# EAGLE design aa battery lado a lado (EAGLE 6.6.0)
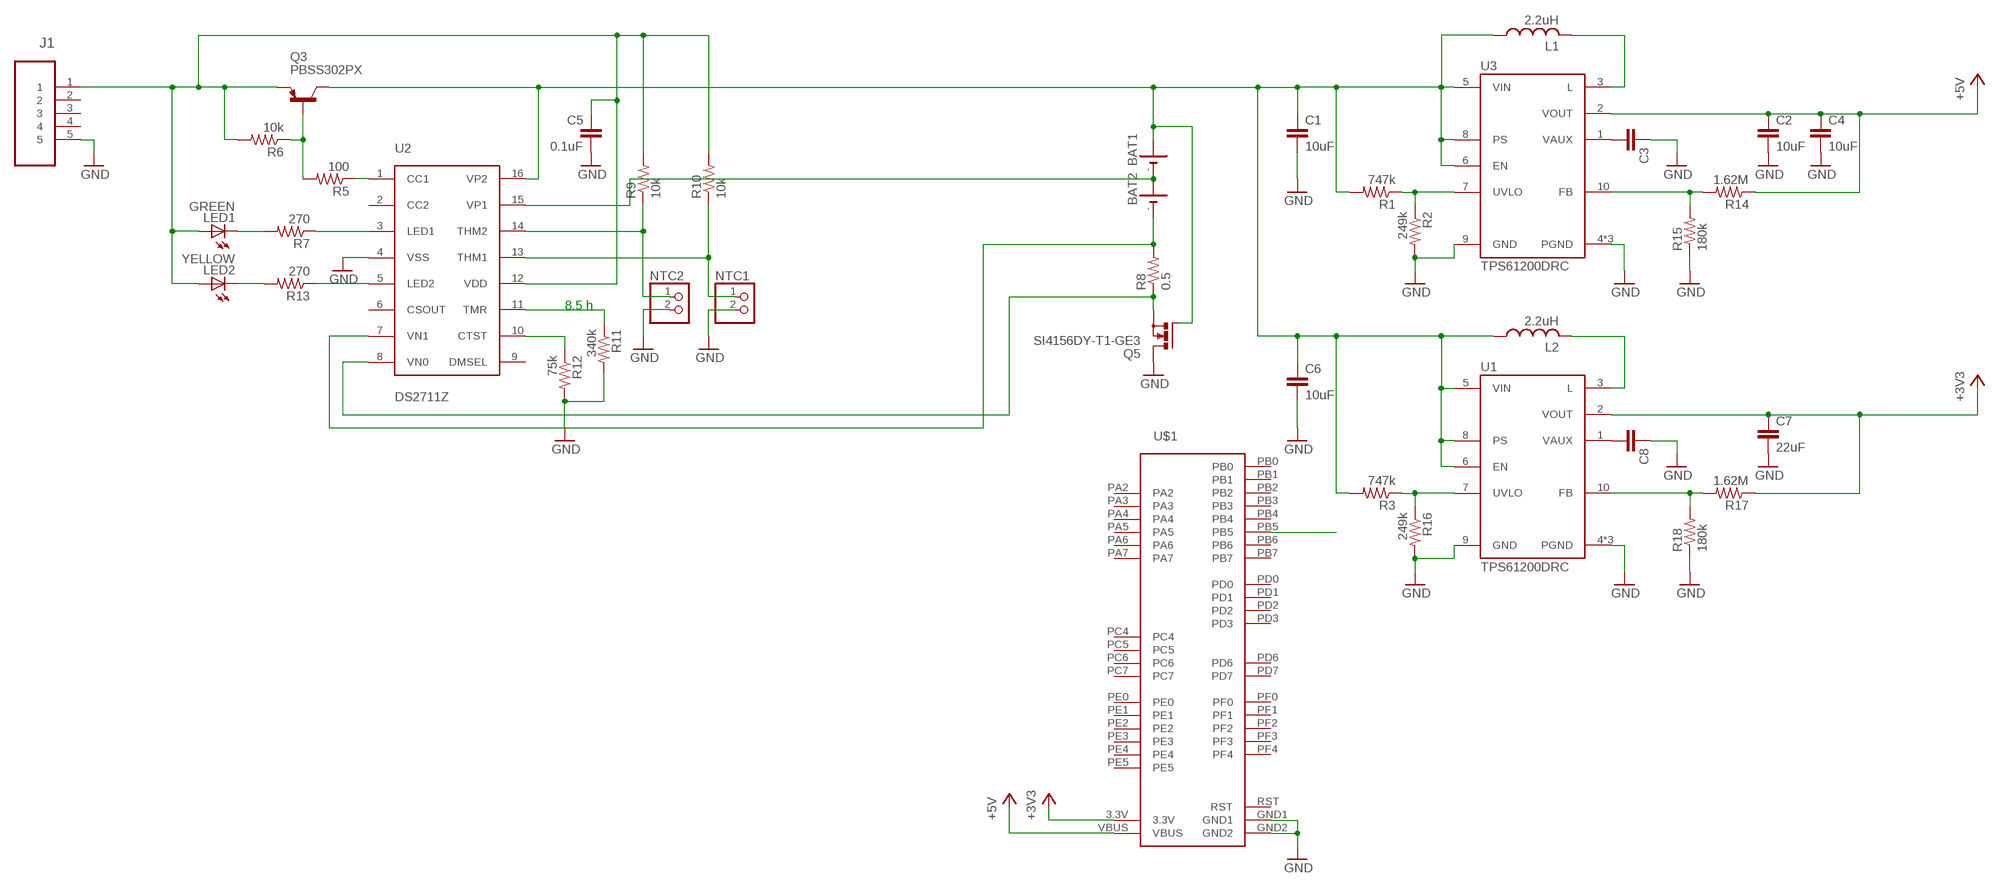
[diagram p0: schematic, sheet 1]

## Parts
BAT1  AA-SNGLKEYSTONE2460  [KEYSTONE2460]
BAT2  AA-SNGLKEYSTONE2460  [KEYSTONE2460]
C1  10uF  C-EUC0805  [C0805]
C2  10uF  C-EUC0805  [C0805]
C3  C-EUC0805  [C0805]
C4  10uF  C-EUC0805  [C0805]
C5  0.1uF  C-EUC0805  [C0805]
C6  10uF  C-EUC0805  [C0805]
C7  22uF  C-EUC0805  [C0805]
C8  C-EUC0603  [C0603]
J1  47346-0001  [MOLEX_47346-0001]
L1  2.2uH  L-USXAL4040  [XAL4040]
L2  2.2uH  L-USXAL4040  [XAL4040]
LED1  GREEN  LEDSML1206  [SML1206]
LED2  YELLOW  LEDSML1206  [SML1206]
NTC1  PINHD-1X2  [1X02]
NTC2  PINHD-1X2  [1X02]
Q3  PBSS302PX  BF621-PNP-SOT98-BCE  [SOT89-BCE]
Q5  SI4156DY-T1-GE3  N-MOSFET-SO8S  [SO-08]
R1  747k  R-US_R0603  [R0603]
R2  249k  R-US_R0603  [R0603]
R3  747k  R-US_R0603  [R0603]
R5  100  R-US_R0805  [R0805]
R6  10k  R-US_R0805  [R0805]
R7  270  R-US_R0805  [R0805]
R8  0.5  R-US_R0805  [R0805]
R9  10k  R-US_R0805  [R0805]
R10  10k  R-US_R0805  [R0805]
R11  340k  R-US_R0805  [R0805]
R12  75k  R-US_R0805  [R0805]
R13  270  R-US_R0805  [R0805]
R14  1.62M  R-US_R0603  [R0603]
R15  180k  R-US_R0603  [R0603]
R16  249k  R-US_R0603  [R0603]
R17  1.62M  R-US_R0603  [R0603]
R18  180k  R-US_R0603  [R0603]
U1  TPS61200DRC  [DRC10_2P4X1P65]
U2  DS2711Z  [SO16]
U3  TPS61200DRC  [DRC10_2P4X1P65]
U$1  STELLARIS-LAUNCHPADSTELLARIS-LAUNCHPAD-XL-HALF-LENGTH  [LAUNCHPAD-XL-HALF-LENGTH]

## Nets
+3V3: C7.1 R17.1 U1.2(VOUT) U$1.3.3V
+5V: C2.1 C4.1 R14.1 U3.2(VOUT) U$1.VBUS
CHG_VCC: C5.1 J1.1 LED1.A LED2.A Q3.E R6.2 R9.2 R10.2 U2.12(VDD)
GND: C1.2 C2.2 C3.1 C4.2 C5.2 C6.2 C7.2 C8.1 J1.5 NTC1.2 NTC2.2 Q5.5(D) Q5.6(D) Q5.7(D) Q5.8(D) R2.2 R11.2 R12.2 R15.1 R16.2 R18.1 U1.4(PGND) U1.9(GND) U1.11(PGND) U1.12(PGND) U2.4(VSS) U3.4(PGND) U3.9(GND) U3.11(PGND) U3.12(PGND) U$1.GND1 U$1.GND2
N$1: BAT1.+ C1.1 C6.1 L1.1 L2.1 Q3.C Q3.C@1(C) Q5.4(G) R1.2 R3.2 U1.5(VIN) U1.6(EN) U1.8(PS) U2.16(VP2) U3.5(VIN) U3.6(EN) U3.8(PS)
N$2: L2.2 U1.3(L)
N$3: R1.1 R2.1 U3.7(UVLO)
N$4: C3.2 U3.1(VAUX)
N$5: R14.2 R15.2 U3.10(FB)
N$6: R3.1 R16.1 U1.7(UVLO)
N$7: Q3.B R5.2 R6.1
N$8: L1.2 U3.3(L)
N$9: C8.2 U1.1(VAUX)
N$10: R5.1 U2.1(CC1)
N$12: R17.2 R18.2 U1.10(FB)
N$13: BAT1.- BAT2.+ U2.15(VP1)
N$14: BAT2.- R8.2 U2.7(VN1)
N$15: LED1.C R7.2
N$16: R7.1 U2.3(LED1)
N$17: NTC2.1 R9.1 U2.14(THM2)
N$18: NTC1.1 R10.1 U2.13(THM1)
N$19: R13.1 U2.5(LED2)
N$20: R12.1 U2.10(CTST)
N$21: R11.1 U2.11(TMR)
N$22: LED2.C R13.2
N$24: Q5.1(S) Q5.2(S) Q5.3(S) R8.1 U2.8(VN0)
N$25: U$1.PB5
Unconnected: J1.2 J1.3 J1.4 U2.2(CC2) U2.6(CSOUT) U2.9(DMSEL) U$1.PA2 U$1.PA3 U$1.PA4 U$1.PA5 U$1.PA6 U$1.PA7 U$1.PB0 U$1.PB1 U$1.PB2 U$1.PB3 U$1.PB4 U$1.PB6 U$1.PB7 U$1.PC4 U$1.PC5 U$1.PC6 U$1.PC7 U$1.PD0 U$1.PD1 U$1.PD2 U$1.PD3 U$1.PD6 U$1.PD7 U$1.PE0 U$1.PE1 U$1.PE2 U$1.PE3 U$1.PE4 U$1.PE5 U$1.PF0 U$1.PF1 U$1.PF2 U$1.PF3 U$1.PF4

## Notes on the sheet
- 8.5 h

## Power pins joined to a net without a drawn wire
RST: U$1.RST

## Library data of the parts
BAT1 BAT2 = battery holders:AA-SNGL
C1-C8 = rcl:C-EU: CAPACITOR, European symbol
J1 = Molex-47346-0001:47346-0001: CONN RCPT 5POS MICRO USB R/A SMD; MPN: 47346-0001; OC_FARNELL: 1568026; OC_NEWARK: 47M0505; PACKAGE: 5 POS MICRO USB R/A; SUPPLIER: MOLEX
L1 L2 = inductors:L-US: INDUCTOR, American symbol
LED1 LED2 = led:LED: LED OSRAM: - CHIPLED LG R971, LG N971, LY N971, LG Q971, LY Q971, LO R971, LY R971 LH N974, LH R974 LS Q976, LO Q976, LY Q976 LO Q996 - Hyper CHIPLED LW Q18S LB Q993, LB Q99A, LB R99A - SideLED LS A670, LO A670, LY A670, LG A670, LP A670 LB A673, LV A673, LT A673, LW A673 LH A674 LY A675 LS A676, LA A676, LO A676, LY A676, LW A676 LS A679, LY A679, LG A679 - Hyper Micro SIDELED® LS Y876, LA Y876, LO Y876, LY Y876 LT Y87S - SmartLED LW L88C, LW L88S LB L89C, LB L89S, LG L890 LS L89K, LO L89K, LY L89K LS L896, LA L896, LO L896, LY L896 - TOPLED LS T670, LO T670, LY T670, LG T670, LP T670 LSG T670, LSP T670, LSY T670, LOP T670, LYG T670 LG T671, LOG T671, LSG T671 LB T673, LV T673, LT T673, LW T673 LH T674 LS T676, LA T676, LO T676, LY T676, LB T676, LH T676, LSB T676, LW T676 LB T67C, LV T67C, LT T67C, LS T67K, LO T67K, LY T67K, LW E67C LS E67B, LA E67B, LO E67B, LY E67B, LB E67C, LV E67C, LT E67C LW T67C LS T679, LY T679, LG T679 LS T770, LO T770, LY T770, LG T770, LP T770 LB T773, LV T773, LT T773, LW T773 LH T774 LS E675, LA E675, LY E675, LS T675 LS T776, LA T776, LO T776, LY T776, LB T776 LHGB T686 LT T68C, LB T68C - Hyper Mini TOPLED® LB M676 - Mini TOPLED Santana® LG M470 LS M47K, LO M47K, LY M47K Source: http://www.osram.convergy.de LUXEON: - LUMILED® LXK2-PW12-R00, LXK2-PW12-S00, LXK2-PW14-U00, LXK2-PW14-V00 LXK2-PM12-R00, LXK2-PM12-S00, LXK2-PM14-U00 LXK2-PE12-Q00, LXK2-PE12-R00, LXK2-PE12-S00, LXK2-PE14-T00, LXK2-PE14-U00 LXK2-PB12-K00, LXK2-PB12-L00, LXK2-PB12-M00, LXK2-PB14-N00, LXK2-PB14-P00, LXK2-PB14-Q00 LXK2-PR12-L00, LXK2-PR12-M00, LXK2-PR14-Q00, LXK2-PR14-R00 LXK2-PD12-Q00, LXK2-PD12-R00, LXK2-PD12-S00 LXK2-PH12-R00, LXK2-PH12-S00 LXK2-PL12-P00, LXK2-PL12-Q00, LXK2-PL12-R00 Source: www.luxeon.com KINGBRIGHT: KA-3528ASYC Source: www.kingbright.com
NTC1 NTC2 = pinhead:PINHD-1X2: PIN HEADER
Q3 = transistor-neu-to92:*-PNP-: PNP Transistror
Q5 = transistor-power:N-MOSFET-SO8: N-Channel MOSFET Example: FDS7760A; N-Channel Logic Level PowerTrench® MOSFET FDS2572; N-Channel UltraFET® Trench MOSFET Source: www.fairchildsemi.com
R1-R3 R5-R18 = rcl:R-US_: RESISTOR, American symbol
U1 U3 = tps61200:TPS61200
U2 = DS2711:DS2711
U$1 = StellarisLaunchPad_Fred:STELLARIS-LAUNCHPAD

## Board
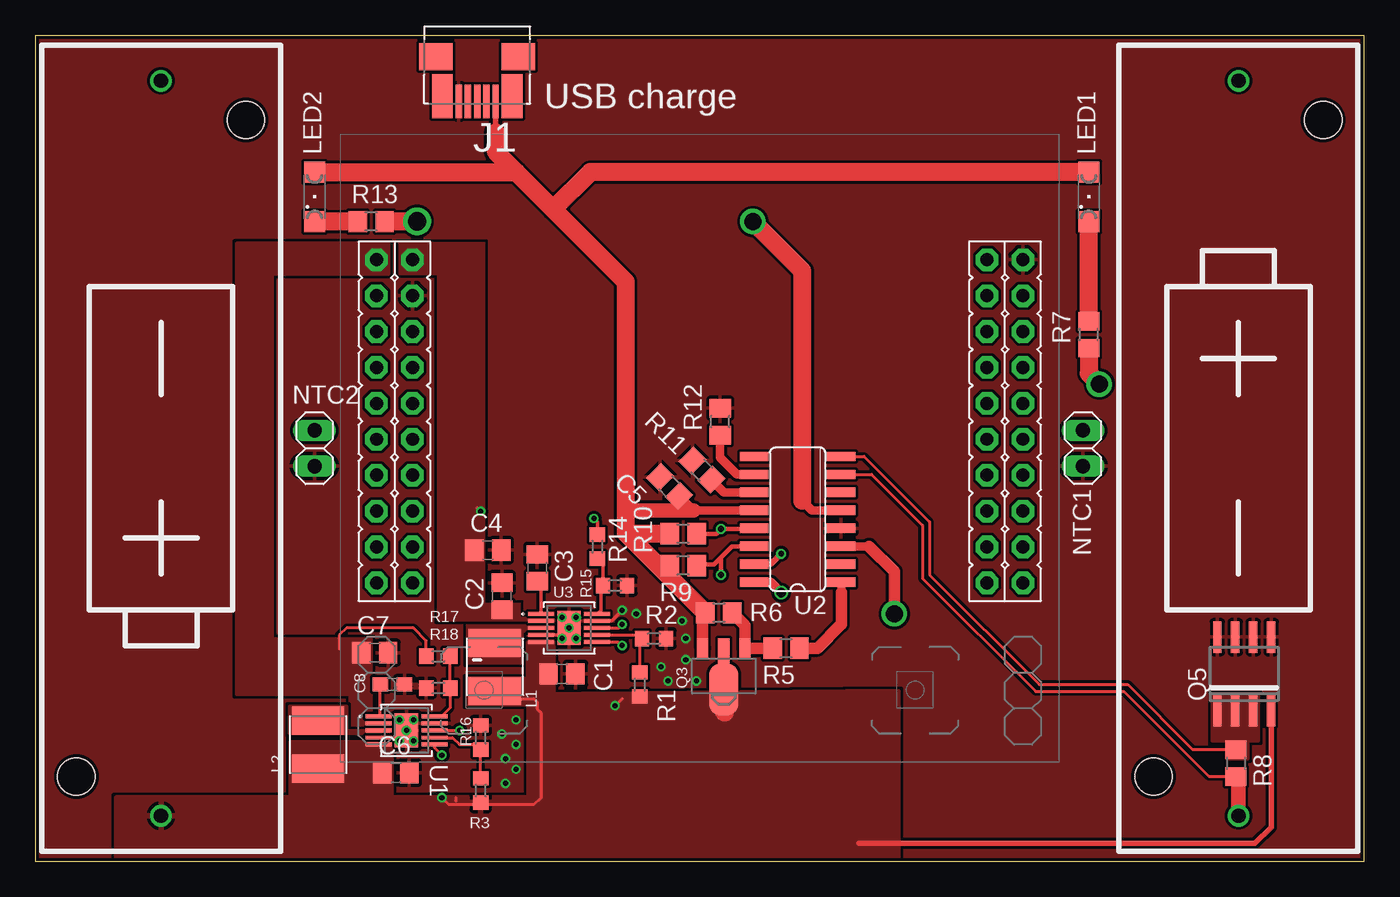
[diagram p1: board, top side]
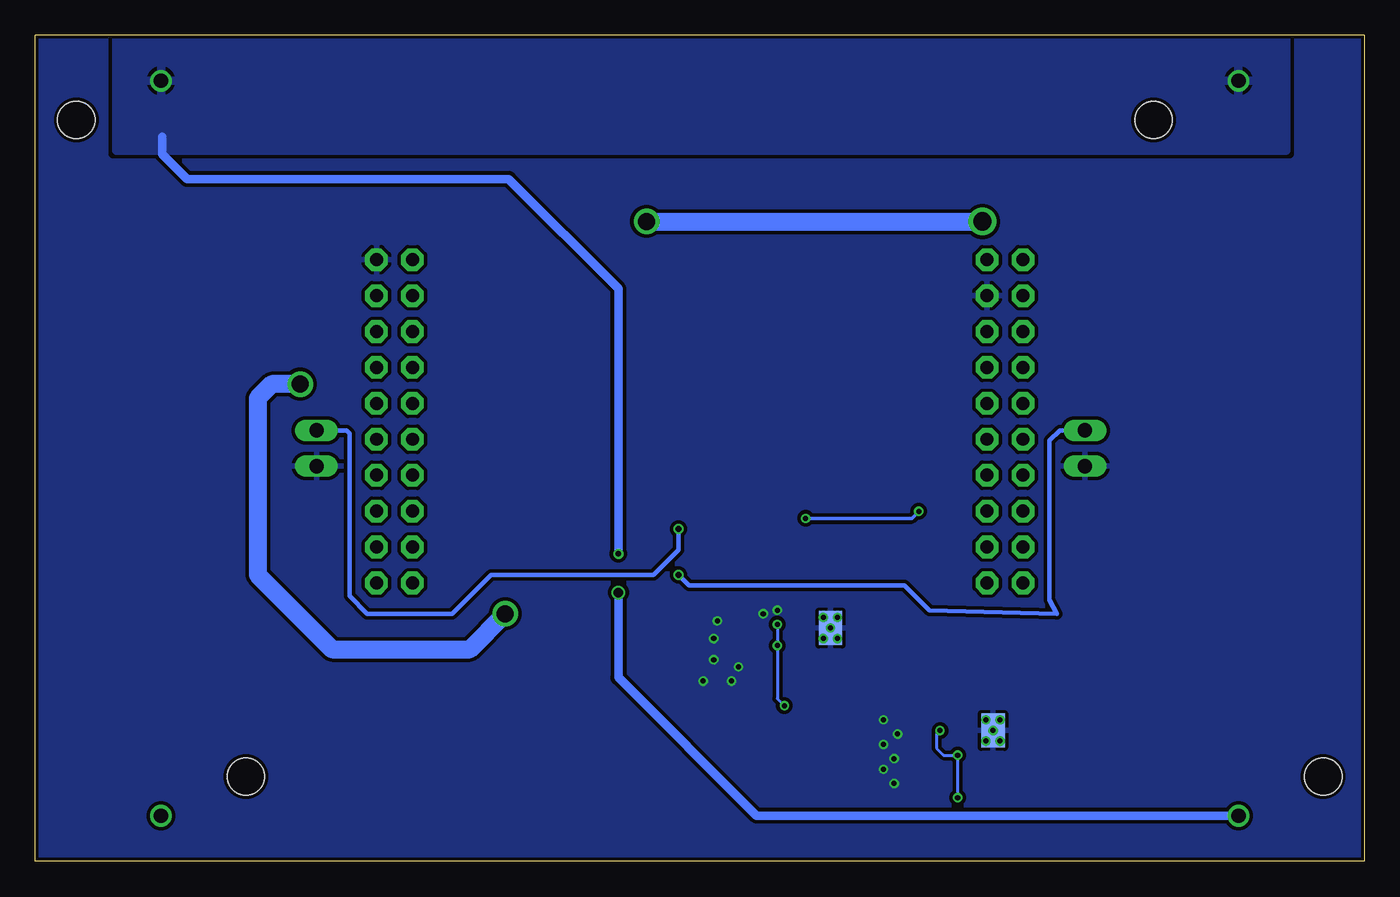
[diagram p2: board, bottom side, seen from below]

Size 93.98 x 58.42 mm. Coordinates in mm from the lower left corner, seen from the top.
Outline: 0,58.42 0,0 93.98,0 93.98,58.42 0,58.42
Copper layers (1*16): Top 0.035mm / dielectric 1.5mm / Bottom 0.035mm
Design rules "ITEADstudio_DRC": minimum track width 6mil, minimum drill 12mil, track to track 6mil, track to pad 6mil, pad to pad 6mil, via to via 6mil, smd to smd 0mil, copper to edge 10mil, drill to drill 10mil, minimum pad ring 10mil, minimum via ring 6mil, stop-mask expansion 2mil, vias tented up to drill 100mil, thermal gap 10mil

### Footprints (pad centres in the part's own frame; a part is rotated, then mirrored left to right if it is on the bottom)
KEYSTONE2460 = drill 1.016: + 25.997,0; - -25.997,0 | hole 2.642: -23.228,5.994; 23.228,-5.994
C0805 = smd 1.3 x 1.5: 1 -0.95,0; 2 0.95,0
C0603 = smd 1.1 x 1: 1 -0.85,0; 2 0.85,0
MOLEX_47346-0001 = smd 0.45 x 2.38: 1 -1.3,0.5; 2 -0.65,0.5; 3 0,0.5; 4 0.65,0.5; 5 1.3,0.5 | smd 1.475 x 3.1: M1 -2.462,0.14; M2 2.462,0.14 | smd 2.375 x 1.9: M3 -2.913,-2.66; M6 2.913,-2.66
XAL4040 = smd 2 x 3.7: 1 -1.695,0; 2 1.695,0
SML1206 = smd 1.5 x 1.5: A 1.75,0; C -1.75,0
1X02 = drill 1.016 long: 1 -1.27,0; 2 1.27,0
SOT89-BCE = smd 0.8 x 1.4: B -1.499,-1.981; E 1.499,-1.981 | smd 0.8 x 1.9: C 0,-1.727 | smd 2.032 x 3.65: C@1 0,0.94
SO-08 = smd 0.6 x 2.2: 1 -1.905,-2.6; 2 -0.635,-2.6; 3 0.635,-2.6; 4 1.905,-2.6; 5 1.905,2.6; 6 0.635,2.6; 7 -0.635,2.6; 8 -1.905,2.6
R0603 = smd 1 x 1.1: 1 -0.85,0; 2 0.85,0
R0805 = smd 1.3 x 1.5: 1 -0.95,0; 2 0.95,0
DRC10_2P4X1P65 = smd 1.838 x 0.279: 1 -1.973,0.991; 2 -1.973,0.508; 3 -1.973,0; 4 -1.973,-0.508; 5 -1.973,-0.991; 6 1.973,-0.991; 7 1.973,-0.508; 8 1.973,0; 9 1.973,0.508; 10 1.973,0.991 | smd 1.65 x 2.4: 11 0,0 | smd 1.65 x 2.4 bottom: 12 0,0
SO16 = smd 0.66 x 2.032: 1 -4.445,-3.073; 2 -3.175,-3.073; 3 -1.905,-3.073; 4 -0.635,-3.073; 5 0.635,-3.073; 6 1.905,-3.073; 7 3.175,-3.073; 8 4.445,-3.073; 9 4.445,3.073; 10 3.175,3.073; 11 1.905,3.073; 12 0.635,3.073; 13 -0.635,3.073; 14 -1.905,3.073; 15 -3.175,3.073; 16 -4.445,3.073
LAUNCHPAD-XL-HALF-LENGTH = drill 0.914 pad 1.6 octagon: 3.3V 8.89,2.54; GND1 11.43,5.08; GND2 8.89,48.26; PA2 31.75,48.26; PA3 29.21,48.26; PA4 26.67,48.26; PA5 26.67,2.54; PA6 29.21,2.54; PA7 31.75,2.54; PB0 13.97,2.54; PB1 16.51,2.54; PB2 11.43,48.26; PB3 13.97,45.72; PB4 24.13,2.54; PB5 11.43,2.54; PB6 24.13,48.26; PB7 21.59,48.26; PC4 16.51,45.72; PC5 19.05,45.72; PC6 21.59,45.72; PC7 24.13,45.72; PD0 13.97,5.08; PD1 16.51,5.08; PD2 19.05,5.08; PD3 21.59,5.08; PD6 26.67,45.72; PD7 29.21,45.72; PE0 13.97,48.26; PE1 24.13,5.08; PE2 26.67,5.08; PE3 29.21,5.08; PE4 19.05,2.54; PE5 21.59,2.54; PF0 16.51,48.26; PF1 31.75,5.08; PF2 8.89,45.72; PF3 11.43,45.72; PF4 31.75,45.72; RST 19.05,48.26; VBUS 8.89,5.08

### Placement (x,y rotation side)
BAT1  8.89,29.21 270 top
BAT2  85.09,29.21 90 top
C1  37.25,13.25 0 top
C2  33,18.75 90 top
C3  35.5,20.75 270 top
C4  32,22 0 top
C5  44.85,26.52 135 top
C6  25.5,6.25 0 top
C7  24,14.75 0 top
C8  25.25,12.5 180 top
J1  31.25,54.25 180 top
L1  32.5,13.75 90 top
L2  20,8.25 90 top
LED1  74.5,47 90 top
LED2  19.75,47 90 top
NTC1  74.09,29.21 270 top
NTC2  19.75,29.21 270 top
Q3  48.69,13.09 180 top
Q5  85.5,13.25 0 top
R1  42.75,12.5 270 top
R2  43.75,15.75 0 top
R3  31.5,5 270 top
R5  53.09,15.06 180 top
R6  48.34,17.57 180 top
R7  74.5,37.25 90 top
R8  84.91,6.93 270 top
R9  45.81,20.91 180 top
R10  45.81,23.16 180 top
R11  47.14,27.66 135 top
R12  48.44,31.09 90 top
R13  23.75,45.25 180 top
R14  39.75,22.25 270 top
R15  41,19.5 180 top
R16  31.5,8.75 90 top
R17  28.5,14.5 0 top
R18  28.5,12.25 0 top
U1  26.25,9.25 0 top
U2  53.91,24.18 90 top
U3  37.75,16.5 0 top
U$1  21.59,51.44 270 top

### Tracks (layer width: path | path; a pad name or v marks a point on that pad's centre or on a via)
+3V3
  Top 0.203: R17.1 27.65,15.6 26.75,16.5 22,16.5 21.5,16 21.5,15
  pour Top (isolate 0.203, rank 2, no thermals): 25.25,9.5 22.25,9.5 22.25,11.75 14.25,11.75 14.25,43.75 25,43.75 25,41.5 16.75,41.5 16.75,15.75 23.75,15.75 23.75,10.5 23.25,10.5 23.25,10 25.25,10
+5V  (via drill 0.36)
  Top 0.254: R14.1 39.75,24 v39.5,24.25 | v31.5,24.75 31.25,25
  Bottom 0.254: v39.5,24.25 32,24.25 v31.5,24.75
  pour Top (no thermals): 25.75,43.75 31.75,43.75 31.75,18.25 34.25,18.25 34.25,17.25 36.75,17.25 36.75,17 28.5,17 28.5,41.5 25.75,41.5
CHG_VCC
  Top 0.406: J1.1 32.55,51.55
  Top 0.61: U2.12 46.55,24.82 C5.1
  Top 0.813: 47.19,17.36 R6.2 | Q3.E 47.19,17.77 46.98,17.98
  Top 1.016: 46.55,24.82 41.82,24.82 41.75,24.75
  Top 1.27: 36.62,46.12 41.75,41 41.75,24.75 41.75,23.2 41.8,23.16 | 44.05,20.91 46.98,17.98 R6.2 | R9.2 44.05,20.91 | 44.05,20.91 41.8,23.16 | R10.2 41.8,23.16 | LED2.A 34,48.75 | 34,48.75 36.62,46.12 | LED1.A 39.25,48.75 36.62,46.12 | 32.55,51.55 32.55,50.2 34,48.75
GND  (via drill 0.36)
  Top 0.203: 38.49,17.01 v38.25,17.25
  Top 0.254: U3.4 37.01,15.99 v37.25,15.75 | U1.4 25.74,8.74 U1.12 | U3.9 40.76,17.01 v41.5,17.75
  other vias: 37.25,17.25 38.25,15.75 37.75,16.5 25.75,10 26.75,10 26.25,9.25 25.75,8.5 26.75,8.5 33.25,5.5 34,6.5 33.25,7.25 34,8.25 33,9 34,10 42.5,17.5 44.25,13.75 44.75,12.75 46.75,12.75 46,14.25 46,15.75 45.75,17
  pour Top (isolate 0.203, rank 6): 0,0 93.98,0 93.98,58.42 0,58.42
  pour Bottom (isolate 0.254, rank 6): 0,0 93.98,0 93.98,58.42 0,58.42
N$1  (via drill 0.36, 0.65)
  Top 0.203: U3.8 41.25,16.5 v41.5,16.75 | U3.6 41.24,15.51 v41.5,15.25 | U1.8 v30,9.25 | 29.75,4.25 29.75,4.5 | U1.6 28.22,8.03 v28.75,7.5 | v41,11 41.5,11.5 | L1.1 32.5,11.75 32.75,11.5 35.25,11.5 35.5,11.25 35.5,10.75 35.75,10.5 35.75,4.5 35.25,4 29.25,4 v28.75,4.5
  Top 0.406: Q5.4 87.41,2.4 86.25,1.25 58.25,1.25
  Top 0.61: U2.16 52.01,19.74 v52.75,19
  Top 0.813: Q3.C Q3.C@1
  Top 1.27: Q3.C@1 48.69,10.56 48.75,10.5
  Bottom 0.203: v41.5,16.75 v41.5,15.25 41.5,11.5 v41,11 | v30,9.25 30.25,9 30.25,8 29.75,7.5 v28.75,7.5 v28.75,4.5
  Bottom 0.61: v52.75,19 52.75,13 42.96,3.21 BAT1.+
  pour Top (no thermals): 30.5,13 35,13 35,11 30.5,11
  pour Top (isolate 0.254): 34.75,4.5 34.75,0 5.75,0 5.75,4.5
  pour Top (no thermals): 34.91,11.75 61,12 61,0 34.91,0
  pour Top (no thermals): 34.75,15.5 34.75,11.75 36.75,11.75 36.75,15.5
  pour Top (no thermals): 25.25,8.25 25.25,4.5 18,4.5 18,8.25 18,8.5 25.25,8.5
N$2
  pour Top (isolate 0.203, no thermals): 25,9 18,9 18,11 22,11 22,9.5 22,9.25 25,9.25
N$3
  Top 0.203: U3.7 42.56,15.99 R2.1 42.75,15.7 R1.1
N$4
  Top 0.254: U3.1 35.78,19.52 C3.2
N$5
  Top 0.254: U3.10 39.74,17.49 40,17.75 40,19.4 R15.2 40.15,21 R14.2
N$6
  Top 0.203: U1.7 29.51,8.74 30,8.25 31.15,8.25 R16.1 R3.1
N$7
  Top 0.813: R6.1 50.18,16.67 Q3.B R5.2
N$8
  pour Top (isolate 0.203, rank 2, no thermals): 36.75,16.75 30.5,16.75 30.5,14 34.5,14 34.5,16.25 36.75,16.25
N$9
  Top 0.203: U1.1 24.4,10.24 C8.2
N$10
  Top 0.61: U2.1 57,19.74 57,18.5
  Top 0.813: R5.1 55.31,15.06 56.98,16.73 57,16.73 57,18.5 57,19
N$12
  Top 0.203: R17.2 R18.2 29.35,10.85 28.74,10.24 U1.10
N$13  (via drill 0.4)
  Top 0.406: U2.15 52.01,21.01 v52.75,21.75
  Bottom 0.61: 85,51.25 85,50 83.25,48.25 60.5,48.25 52.75,40.5 v52.75,21.75
  pour Bottom (isolate 0.254): 5.5,58.25 5.5,53.75 5.5,50.25 88.25,50.25 88.25,58.5 5.5,58.5
N$14
  Top 0.203: U2.7 59.14,27.36 62.75,23.75 62.75,20 70.75,12 77,12 83,6 84.89,6 R8.2
  Top 1.016: BAT2.- 85.09,5.8 R8.2
N$15
  Top 1.27: R7.2 LED1.C
N$16  (via drill 1.2)
  Top 0.61: U2.3 58.97,22.28
  Top 0.813: v60.75,17.5 60.75,20.5 58.97,22.28
  Top 1.27: R7.1 74.5,34.5 v75.25,33.75
  Bottom 1.27: v75.25,33.75 77.25,33.75 78.25,32.75 78.25,20.25 73,15 63.25,15 v60.75,17.5
N$17  (via drill 0.41)
  Top 0.305: U2.14 49.28,22.28 48.5,21.5 | 48.5,21.5 v48.5,20.25 | 46.85,21 48,21 48.5,21.5
  Top 0.61: 46.85,21 R9.1
  Bottom 0.305: NTC2.1 21.52,30.48 22.25,29.75 22.25,18.5 21.75,17.5 30.75,17.75 32.5,19.5 47.75,19.5 v48.5,20.25
N$18  (via drill 0.41)
  Top 0.305: U2.13 50.84,23.5 v48.5,23.5 48.16,23.16 R10.1
  Bottom 0.305: v48.5,23.5 48.5,22 50.25,20.25 61.75,20.25 64.5,17.5 70.5,17.5 71.75,18.75 71.75,29.25 71.75,29.75 71.75,30.25 71.98,30.48 NTC1.1
N$19  (via drill 1.2, 1.3)
  Top 0.61: U2.5 54.93,24.82 54.25,25.5
  Top 1.27: 54.25,25.5 54.25,41.75 v50.75,45.25 | v27,45.25 R13.1
  Bottom 1.27: v50.75,45.25 v27,45.25
N$20
  Top 0.61: U2.10 49.64,27.36 48.44,28.57 R12.1
N$21
  Top 0.61: U2.11 48.72,26.09 R11.1
N$22
  Top 1.27: R13.2 LED2.C
N$24
  Top 0.203: U2.8 58.62,28.63 63.25,24 63.25,20.25 71,12.5 77.25,12.5 81.86,7.88 R8.1
  pour Top (no thermals): 84.25,7.25 85.75,7.25 85.75,8.5 86.5,8.5 86.5,11.75 83.25,11.75 83.25,8.5 84.25,8.5

### Text on the board
tPlace: USB charge